# EasyEDA schematic schematic.json
TITLE: Sheet_1; REV: 1.0; Date: 2020-10-27; Sheet: 1/1; Drawn By: RBEGamer; Company: Your Company
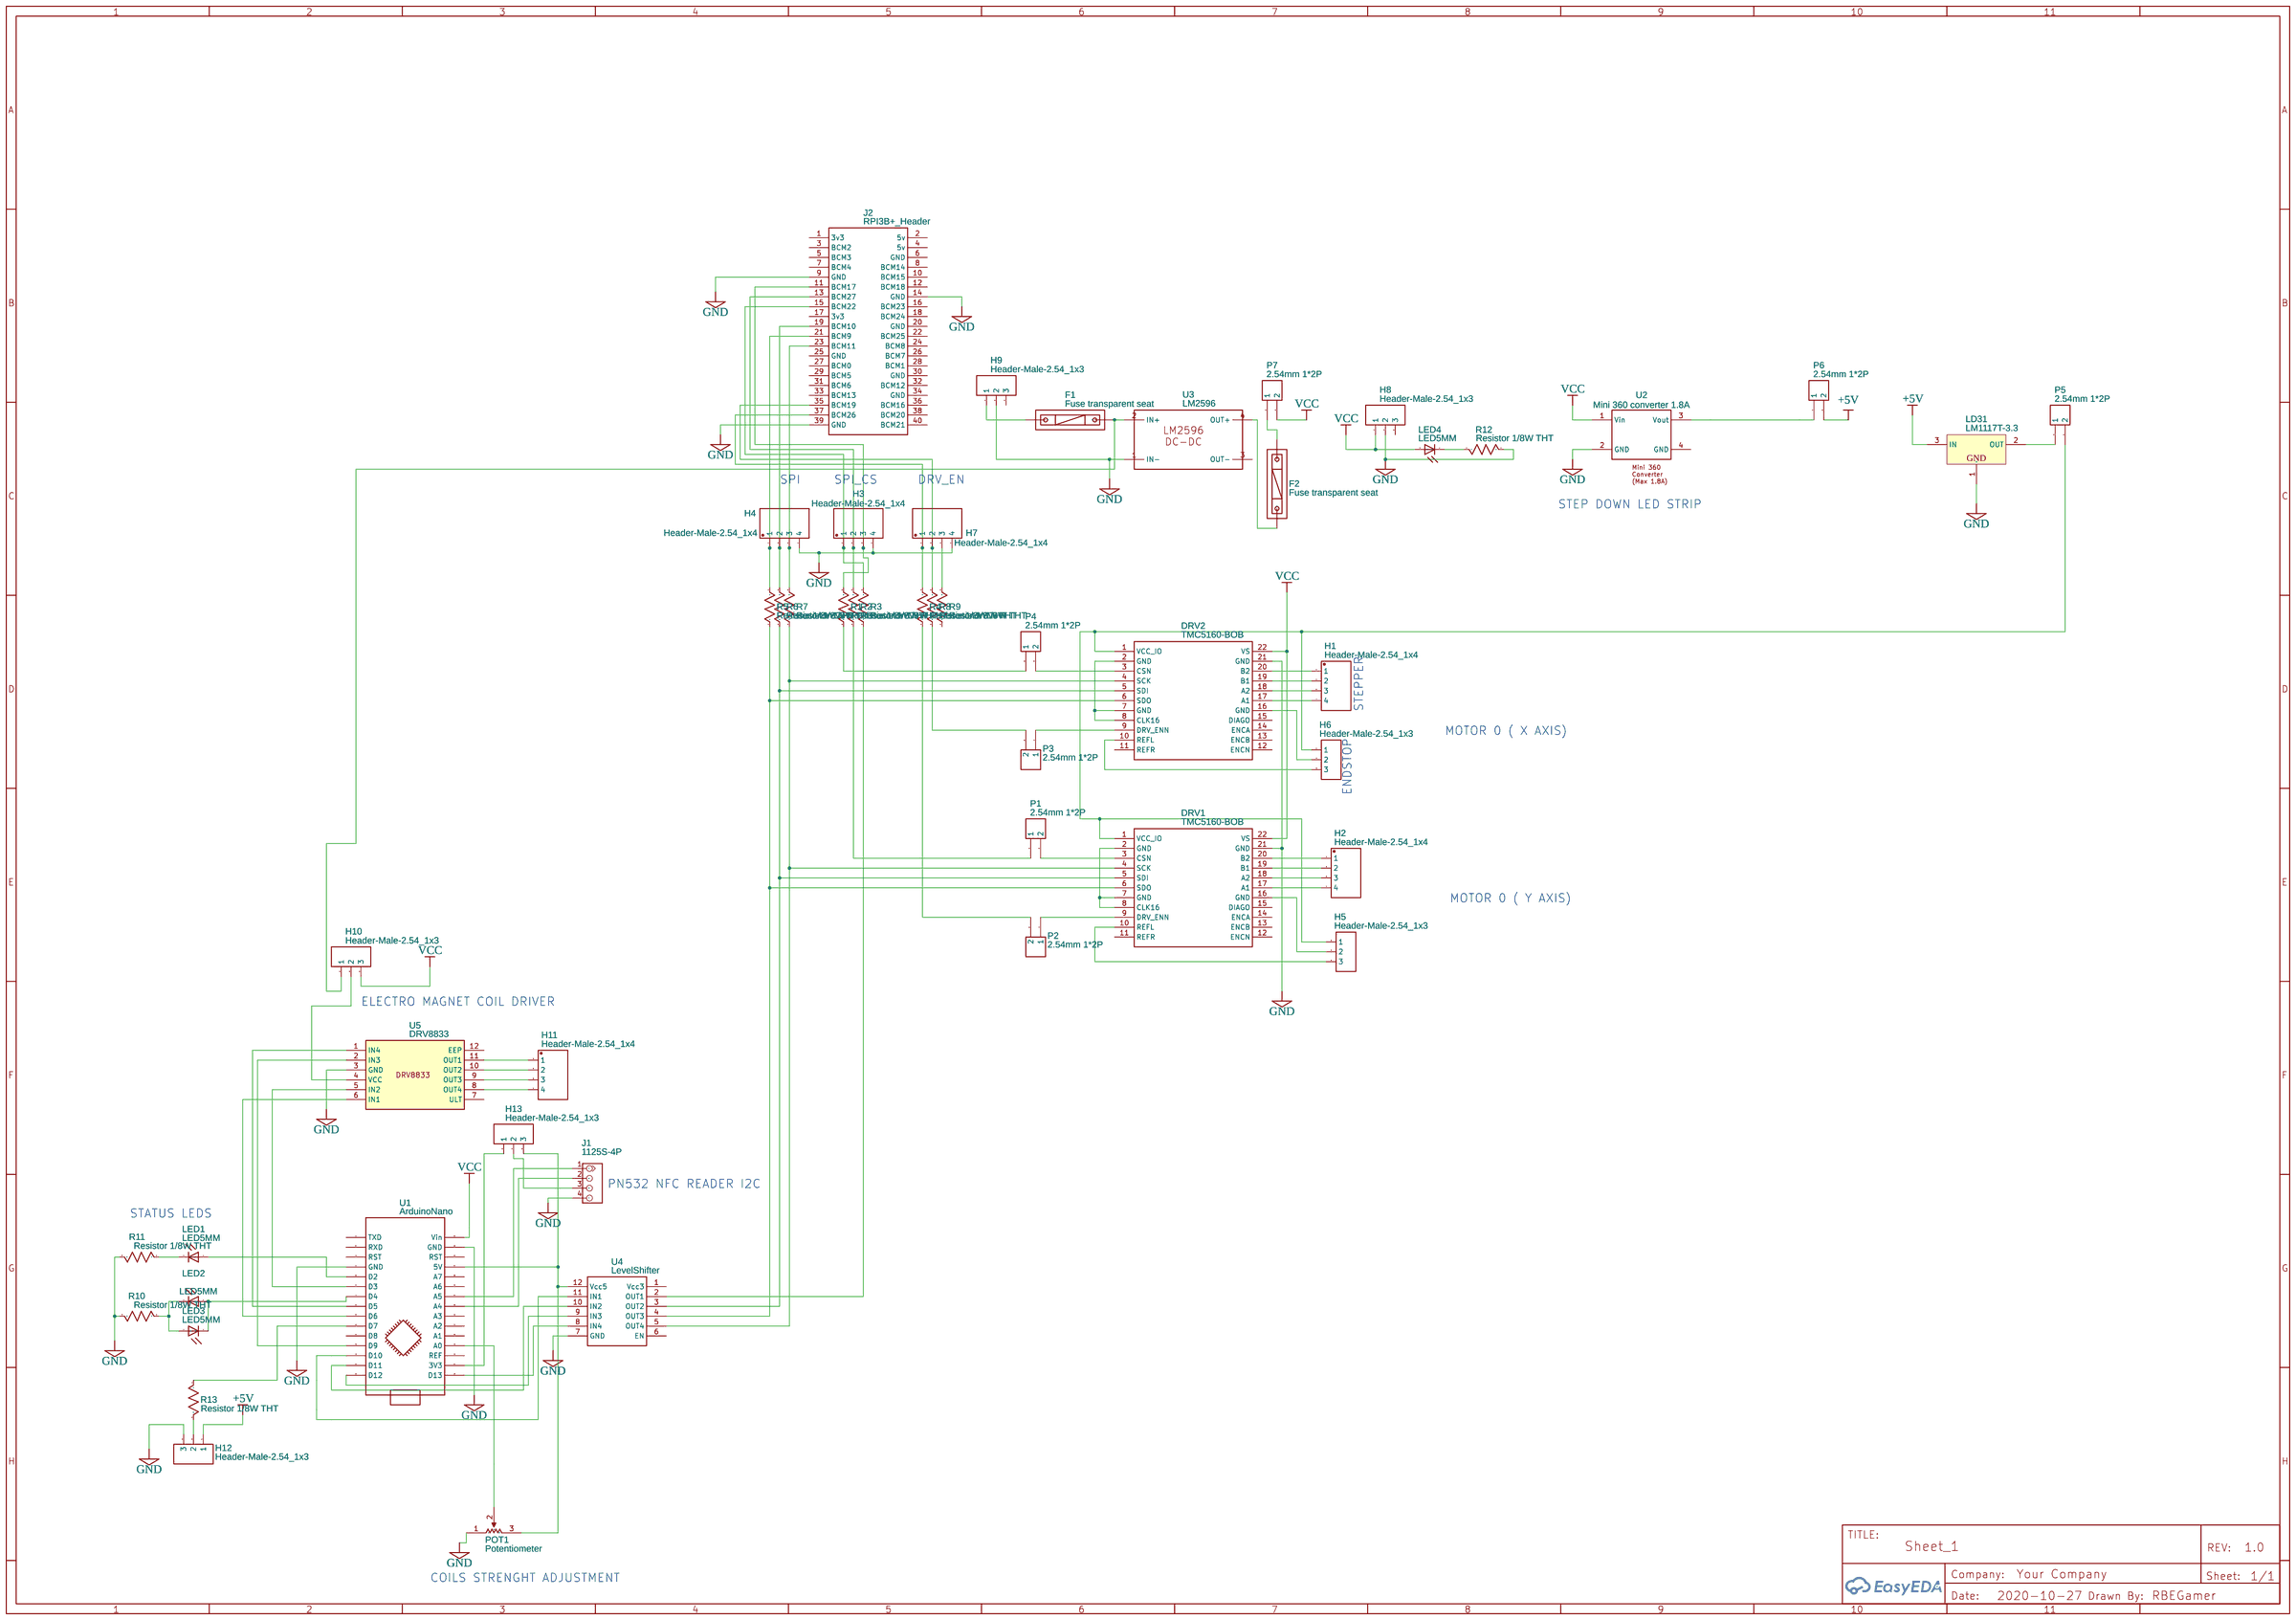
[diagram p0: schematic sheet]

## Parts
DRV1  TMC5160-BOB  [TMC5160-BOB]
DRV2  TMC5160-BOB  [TMC5160-BOB]
F1  Fuse transparent seat  [FUSE-TH_L22.6-W9.0]
F2  Fuse transparent seat  [FUSE-TH_L22.6-W9.0]
H1  Header-Male-2.54_1x4  [HDR-TH_4P-P2.54-V]
H2  Header-Male-2.54_1x4  [HDR-TH_4P-P2.54-V]
H3  Header-Male-2.54_1x4  [HDR-TH_4P-P2.54-V]
H4  Header-Male-2.54_1x4  [HDR-TH_4P-P2.54-V]
H5  Header-Male-2.54_1x3  [HDR-TH_3P-P2.54-V]
H6  Header-Male-2.54_1x3  [HDR-TH_3P-P2.54-V]
H7  Header-Male-2.54_1x4  [HDR-TH_4P-P2.54-V]
H8  Header-Male-2.54_1x3  [HDR-TH_3P-P2.54-V]
H9  Header-Male-2.54_1x3  [HDR-TH_3P-P2.54-V]
H10  Header-Male-2.54_1x3  [HDR-TH_3P-P2.54-V]
H11  Header-Male-2.54_1x4  [HDR-TH_4P-P2.54-V]
H12  Header-Male-2.54_1x3  [HDR-TH_3P-P2.54-V]
H13  Header-Male-2.54_1x3  [HDR-TH_3P-P2.54-V]
J1  1125S-4P  [HW4-2.0]
J2  RPI3B+_Header  [2X20_2.54_HEADER]
LD31  LM1117T-3.3  [T03B]
LED1  LED5MM  [LED5MM]
LED2  LED5MM  [LED5MM]
LED3  LED5MM  [LED5MM]
LED4  LED5MM  [LED5MM]
P1  2.54mm 1*2P  [HDR-TH_2P-P2.54-V-M]
P2  2.54mm 1*2P  [HDR-TH_2P-P2.54-V-M]
P3  2.54mm 1*2P  [HDR-TH_2P-P2.54-V-M]
P4  2.54mm 1*2P  [HDR-TH_2P-P2.54-V-M]
P5  2.54mm 1*2P  [HDR-TH_2P-P2.54-V-M]
P6  2.54mm 1*2P  [HDR-TH_2P-P2.54-V-M]
P7  2.54mm 1*2P  [HDR-TH_2P-P2.54-V-M]
POT1  Potentiometer  [MY_POT]
R1  Resistor 1/8W THT  [RESISTOR 1/8W THT]
R2  Resistor 1/8W THT  [RESISTOR 1/8W THT]
R3  Resistor 1/8W THT  [RESISTOR 1/8W THT]
R4  Resistor 1/8W THT  [RESISTOR 1/8W THT]
R5  Resistor 1/8W THT  [RESISTOR 1/8W THT]
R6  Resistor 1/8W THT  [RESISTOR 1/8W THT]
R7  Resistor 1/8W THT  [RESISTOR 1/8W THT]
R8  Resistor 1/8W THT  [RESISTOR 1/8W THT]
R9  Resistor 1/8W THT  [RESISTOR 1/8W THT]
R10  Resistor 1/8W THT  [RESISTOR 1/8W THT]
R11  Resistor 1/8W THT  [RESISTOR 1/8W THT]
R12  Resistor 1/8W THT  [RESISTOR 1/8W THT]
R13  Resistor 1/8W THT  [RESISTOR 1/8W THT]
U1  ArduinoNano  [ARDUINO NANO VINCENT]
U2  Mini 360 converter 1.8A  [MINI 360 STEP DOWN CONVERTER 1.8A]
U3  LM2596  [STEP_DOWN_LM2596S]
U4  LevelShifter  [12PIN]
U5  DRV8833  [DRV8833 MOTOR DRIVER]

## Library data of the parts
DRV1 DRV2 = TMC5160-BOB: Manufacturer: TRINAMIC MOTION CONTROL GmbH; Contributor: alexackerman96
F1 F2 = Fuse transparent seat: Supplier: LCSC; Manufacturer: ReliaPro; image: //image.lceda.cn/szlcsc/C58066.jpg; Supplier Part: C58066
H1-H4 H7 H11 = Header-Male-2.54_1x4: Supplier: LCSC; Manufacturer: Ckmtw; Manufacturer Part: 210S-1*4P L=11.6MMGold-plated black; Contributor: LCSC; Supplier Part: C124378
H5 H6 H8-H10 H12 H13 = Header-Male-2.54_1x3: Supplier: LCSC; Manufacturer: BOOMELE; Manufacturer Part: Header2.54mm 1*3P; image: //image.lceda.cn/szlcsc/C49257.jpg; Supplier Part: C49257
J1 = 1125S-4P: DIP Grove
J2 = RPI3B+_Header: Manufacturer Part: 61304021121; Supplier: Digi-Key; Supplier Part: 732-5310-ND; link: https://www.digikey.fr/product-detail/fr/wurth-electronics-inc/61304021121/732-5310-ND/4846886; Contributor: boulou
LD31 = LM1117T-3.3: Manufacturer: National Semiconductor; Contributor: M474
LED1-LED4 = LED5MM: LEDs; Contributor: Pinoccio
P1-P7 = 2.54mm 1*2P: Supplier: LCSC; Manufacturer: ReliaPro; image: http://image.lceda.cn/szlcsc/C36717.jpg; Supplier Part: C36717
POT1 = Potentiometer: Manufacturer Part: potentiometer; Contributor: Tommaso Mariotti
R1-R13 = Resistor 1/8W THT: Manufacturer: Generic; Manufacturer Part: Generic; Supplier: Mouser; Supplier Part: Generic; Contributor: tyvogelpohl
U1 = ArduinoNano: Contributor: vincint810923
U2 = Mini 360 converter 1.8A: Manufacturer Part: Mini 360 step down converter 1.8A; link: Input Voltage: 4.75V-23V  Output Voltage: 1.0V-17V  Output Current: Peak 3A, long 1.8A  Conversion Efficiency: 96% (the highest); Contributor: Hankwon Chang (InterStellarCloud)
U3 = LM2596: Contributor: Azriel Hutagalung
U4 = LevelShifter: Contributor: max.helmrich
U5 = DRV8833: sourceId: YsmgyP7pj

## Nets
+5V: H12.1 LD31.3(IN) P6.2
GND: DRV1.21(GND) DRV2.21(GND) H3.4 H4.4 H7.4 H8.2 H9.2 H12.3 J1.4 J2.9(GND) J2.14(GND) J2.39(GND) LD31.1(GND) POT1.1 R10.2 R11.2 R12.2 U1.4(GND) U1.29(GND) U2.2(GND) U3.1(IN-) U4.7(GND) U5.3(GND)
VCC: DRV1.22(VS) DRV2.22(VS) H8.1 H10.3 LED4.A P7.2 U1.30(Vin) U2.1(Vin)
Net-(DRV1-1): DRV1.1(VCC_IO) DRV2.1(VCC_IO) H5.1 H6.1 P5.2
Net-(DRV1-2): DRV1.2(GND) DRV1.7(GND) DRV1.8(CLK16)
Net-(DRV1-3): DRV1.3(CSN) P1.2
Net-(DRV1-4): DRV1.4(SCK) DRV2.4(SCK) R7.1 U4.5(OUT4)
Net-(DRV1-5): DRV1.5(SDI) DRV2.5(SDI) R6.1 U4.3(OUT2)
Net-(DRV1-6): DRV1.6(SDO) DRV2.6(SDO) R5.1 U4.4(OUT3)
Net-(DRV1-9): DRV1.9(DRV_ENN) P2.1
Net-(DRV1-10): DRV1.10(REFL) H5.3
Net-(DRV1-16): DRV1.16(GND) H5.2
Net-(DRV1-17): DRV1.17(A1) H2.4
Net-(DRV1-18): DRV1.18(A2) H2.3
Net-(DRV1-19): DRV1.19(B1) H2.2
Net-(DRV1-20): DRV1.20(B2) H2.1
Net-(DRV2-2): DRV2.2(GND) DRV2.7(GND) DRV2.8(CLK16)
Net-(DRV2-3): DRV2.3(CSN) P4.2
Net-(DRV2-9): DRV2.9(DRV_ENN) P3.1
Net-(DRV2-10): DRV2.10(REFL) H6.3
Net-(DRV2-16): DRV2.16(GND) H6.2
Net-(DRV2-17): DRV2.17(A1) H1.4
Net-(DRV2-18): DRV2.18(A2) H1.3
Net-(DRV2-19): DRV2.19(B1) H1.2
Net-(DRV2-20): DRV2.20(B2) H1.1
Net-(F1-1): F1.1 H9.1
Net-(F1-2): F1.2 H10.1 U3.2(IN+)
Net-(F2-1): F2.1 U3.4(OUT+)
Net-(F2-2): F2.2 P7.1
Net-(H3-1): H3.1 J2.15(BCM22) R3.2
Net-(H3-2): H3.2 J2.13(BCM27) R2.2
Net-(H3-3): H3.3 J2.11(BCM17) R1.2
Net-(H4-1): H4.1 J2.21(BCM9) R5.2
Net-(H4-2): H4.2 J2.19(BCM10) R6.2
Net-(H4-3): H4.3 J2.23(BCM11) R7.2
Net-(H7-1): H7.1 J2.37(BCM26) R4.2
Net-(H7-2): H7.2 J2.35(BCM19) R8.2
Net-(H7-3): H7.3 R9.2
Net-(H10-2): H10.2 U5.4(VCC)
Net-(H11-1): H11.1 U5.11(OUT1)
Net-(H11-2): H11.2 U5.10(OUT2)
Net-(H11-3): H11.3 U5.9(OUT3)
Net-(H11-4): H11.4 U5.8(OUT4)
Net-(H12-2): H12.2 R13.2
Net-(H13-1): H13.1 U1.17(3V3)
Net-(H13-2): H13.2 J1.3
Net-(H13-3): H13.3 POT1.3 U1.27(5V) U4.12(Vcc5)
Net-(J1-1): J1.1 U1.24(A5)
Net-(J1-2): J1.2 U1.23(A4)
Net-(LD31-2): LD31.2(OUT) P5.1
Net-(LED1-A): LED1.A U1.5(D2)
Net-(LED1-K): LED1.K(C) R11.1
Net-(LED2-A): LED2.A LED3.K(C) U1.7(D4)
Net-(LED2-K): LED2.K(C) LED3.A R10.1
Net-(LED4-K): LED4.K(C) R12.1
Net-(P1-1): P1.1 R2.1
Net-(P2-2): P2.2 R4.1
Net-(P3-2): P3.2 R8.1
Net-(P4-1): P4.1 R1.1
Net-(P6-1): P6.1 U2.3(Vout)
Net-(POT1-2): POT1.2 U1.19(A0)
Net-(R3-1): R3.1 U4.2(OUT1)
Net-(R13-1): R13.1 U1.10(D7)
Net-(U1-6): U1.6(D3) U5.5(IN2)
Net-(U1-8): U1.8(D5) U5.1(IN4)
Net-(U1-9): U1.9(D6) U5.6(IN1)
Net-(U1-12): U1.12(D9) U5.2(IN3)
Net-(U1-13): U1.13(D10) U4.11(IN1)
Net-(U1-14): U1.14(D11) U4.10(IN2)
Net-(U1-15): U1.15(D12) U4.9(IN3)
Net-(U1-16): U1.16(D13) U4.8(IN4)

Not connected (* = marked no-connect by the designer): DRV1 11(REFR) 12(ENCN) 13(ENCB) 14(ENCA) 15(DIAGO); DRV2 11(REFR) 12(ENCN) 13(ENCB) 14(ENCA) 15(DIAGO); H8 3; H9 3; J2 1(3v3) 2(5v) 3(BCM2) 4(5v) 5(BCM3) 6(GND) 7(BCM4) 8(BCM14) 10(BCM15) 12(BCM18) 16(BCM23) 17(3v3) 18(BCM24) 20(GND) 22(BCM25) 24(BCM8) 25(GND) 26(BCM7) 27(BCM0) 28(BCM1) 29(BCM5) 30(GND) 31(BCM6) 32(BCM12) 33(BCM13) 34(GND) 36(BCM16) 38(BCM20) 40(BCM21); R9 1; U1 1(TXD) 2(RXD) 3(RST) 11(D8) 18(REF) 20(A1) 21(A2) 22(A3) 25(A6) 26(A7) 28(RST); U2 4(GND); U3 3(OUT-); U4 1(Vcc3) 6(EN); U5 7(ULT) 12(EEP)

## Notes on the sheet
- SPI
- SPI_CS
- DRV_EN
- STEP DOWN LED STRIP
- STEPPER
- MOTOR 0 ( X AXIS)
- ENDSTOP
- MOTOR 0 ( Y AXIS)
- ELECTRO MAGNET COIL DRIVER
- PN532 NFC READER I2C
- STATUS LEDS
- COILS STRENGHT ADJUSTMENT
